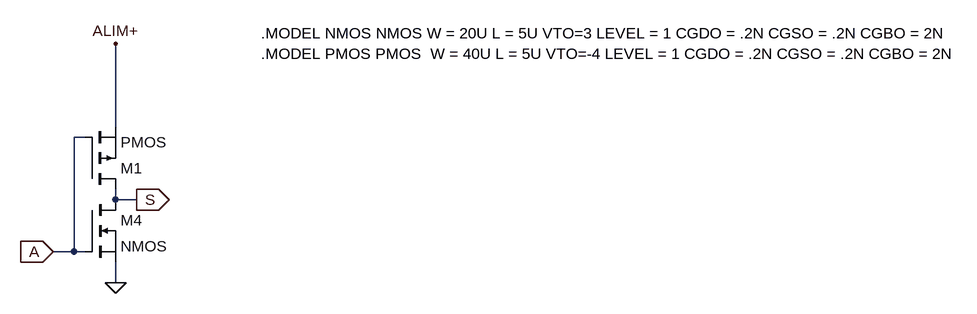
[diagram p0: schematic 74HC04.asc]
74HC04.asc, the LTspice schematic file:
Version 4
SHEET 1 1612 680
WIRE 176 112 176 -16
WIRE 128 128 112 128
WIRE 176 224 176 208
WIRE 208 224 176 224
WIRE 112 304 112 128
WIRE 112 304 80 304
WIRE 128 304 112 304
WIRE 176 352 176 320
FLAG 208 224 S
IOPIN 208 224 Out
FLAG 176 352 0
FLAG 80 304 A
IOPIN 80 304 In
FLAG 176 -16 ALIM+
SYMBOL pmos 128 208 M180
SYMATTR InstName M1
SYMBOL nmos 128 224 R0
SYMATTR InstName M4
TEXT 400 -32 Left 0 !.MODEL NMOS NMOS W = 20U L = 5U VTO=3 LEVEL = 1 CGDO = .2N CGSO = .2N CGBO = 2N\n.MODEL PMOS PMOS  W = 40U L = 5U VTO=-4 LEVEL = 1 CGDO = .2N CGSO = .2N CGBO = 2N

The netlist it stands for:
* 74HC04.asc
M1 S A ALIM+ ALIM+ PMOS
M4 S A 0 0 NMOS
.model NMOS NMOS
.model PMOS PMOS
.lib standard.mos
.MODEL NMOS NMOS W = 20U L = 5U VTO=3 LEVEL = 1 CGDO = .2N CGSO = .2N CGBO = 2N
.MODEL PMOS PMOS  W = 40U L = 5U VTO=-4 LEVEL = 1 CGDO = .2N CGSO = .2N CGBO = 2N
.backanno
.end